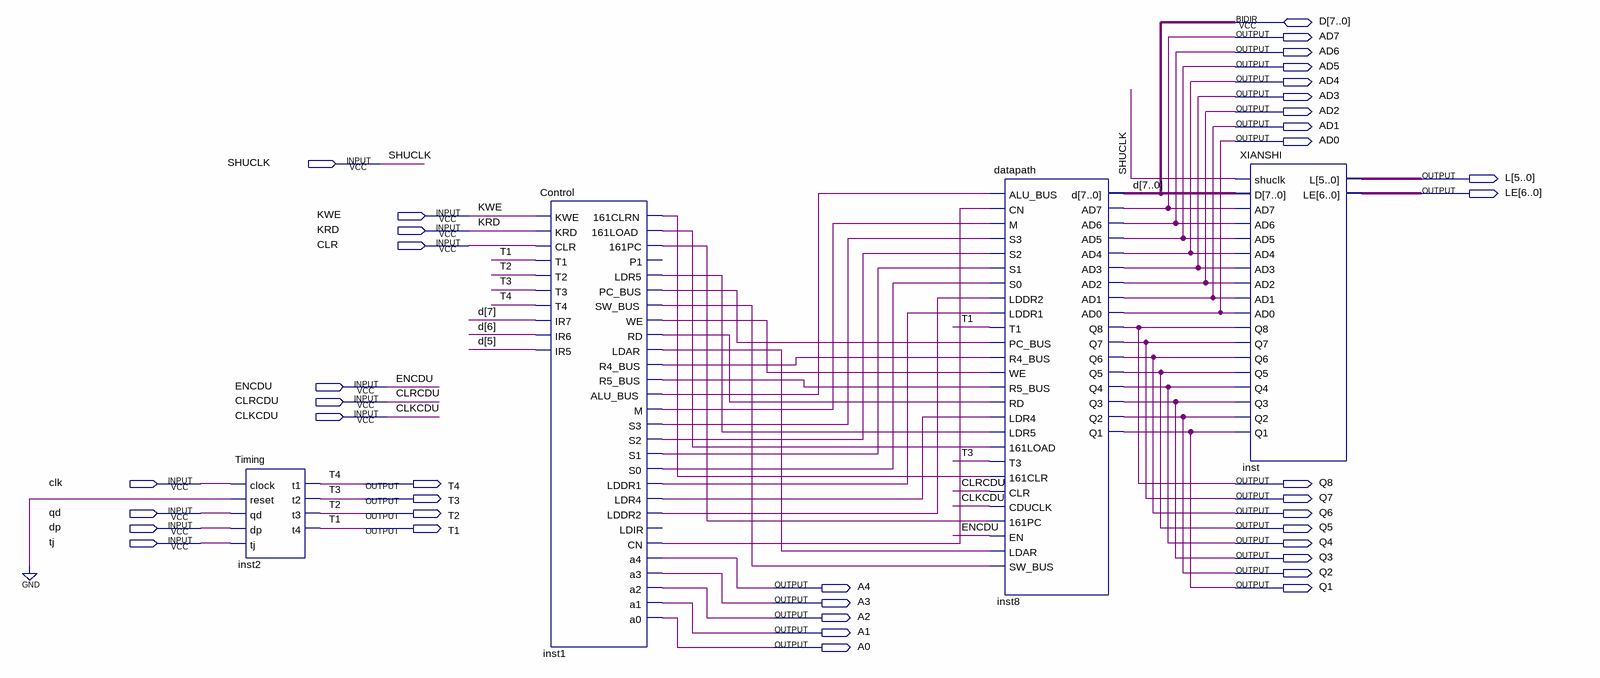
[diagram p0: schematic sheet]
// Quartus schematic Computer.bdf as structural Verilog: 4 symbols, 39 pins
module Computer (
  input  SHUCLK,
  input  KWE,
  input  KRD,
  input  CLR,
  input  ENCDU,
  input  CLRCDU,
  input  CLKCDU,
  input  clk,
  input  qd,
  input  dp,
  input  tj,
  inout  [7:0] D,
  output AD7,
  output AD6,
  output AD5,
  output AD4,
  output AD3,
  output AD2,
  output AD1,
  output AD0,
  output [5:0] L,
  output [6:0] LE,
  output T4,
  output Q8,
  output T3,
  output Q7,
  output T2,
  output Q6,
  output T1,
  output Q5,
  output Q4,
  output Q3,
  output Q2,
  output A4,
  output Q1,
  output A3,
  output A2,
  output A1,
  output A0
);

  wire inst1_161clrn, inst1_161load, inst1_161pc, inst1_alu_bus, inst1_cn, inst1_ldar, inst1_lddr1,
       inst1_lddr2, inst1_ldr4, inst1_ldr5, inst1_m, inst1_pc_bus, inst1_r4_bus, inst1_r5_bus, inst1_rd,
       inst1_s0, inst1_s1, inst1_s2, inst1_s3, inst1_sw_bus, inst1_we;

  Timing inst2 (.clock(clk), .reset(1'b0), .qd(qd), .dp(dp), .tj(tj), .t1(T4), .t2(T3), .t3(T2), .t4(T1));
  Control inst1 (
    .KWE(KWE), .KRD(KRD), .CLR(CLR), .T1(T1), .T2(T2), .T3(T3), .T4(T4), .IR7(D[7]), .IR6(D[6]), .IR5(D[5]),
    .\161CLRN (inst1_161clrn), .\161LOAD (inst1_161load), .\161PC (inst1_161pc), .LDR5(inst1_ldr5),
    .PC_BUS(inst1_pc_bus), .SW_BUS(inst1_sw_bus), .WE(inst1_we), .RD(inst1_rd), .LDAR(inst1_ldar),
    .R4_BUS(inst1_r4_bus), .R5_BUS(inst1_r5_bus), .ALU_BUS(inst1_alu_bus), .M(inst1_m), .S3(inst1_s3),
    .S2(inst1_s2), .S1(inst1_s1), .S0(inst1_s0), .LDDR1(inst1_lddr1), .LDR4(inst1_ldr4), .LDDR2(inst1_lddr2),
    .CN(inst1_cn), .a4(A4), .a3(A3), .a2(A2), .a1(A1), .a0(A0));  // open: P1, LDIR
  datapath inst8 (
    .ALU_BUS(inst1_alu_bus), .CN(inst1_cn), .M(inst1_m), .S3(inst1_s3), .S2(inst1_s2), .S1(inst1_s1),
    .S0(inst1_s0), .LDDR2(inst1_lddr2), .LDDR1(inst1_lddr1), .T1(T1), .PC_BUS(inst1_pc_bus),
    .R4_BUS(inst1_r4_bus), .WE(inst1_we), .R5_BUS(inst1_r5_bus), .RD(inst1_rd), .LDR4(inst1_ldr4),
    .LDR5(inst1_ldr5), .\161LOAD (inst1_161load), .T3(T3), .\161CLR (inst1_161clrn), .CLR(CLRCDU),
    .CDUCLK(CLKCDU), .\161PC (inst1_161pc), .EN(ENCDU), .LDAR(inst1_ldar), .SW_BUS(inst1_sw_bus), .AD7(AD7),
    .AD6(AD6), .AD5(AD5), .AD4(AD4), .AD3(AD3), .AD2(AD2), .AD1(AD1), .AD0(AD0), .Q8(Q8), .Q7(Q7), .Q6(Q6),
    .Q5(Q5), .Q4(Q4), .Q3(Q3), .Q2(Q2), .Q1(Q1), .d(D));
  XIANSHI inst (
    .shuclk(SHUCLK), .D(D), .AD7(AD7), .AD6(AD6), .AD5(AD5), .AD4(AD4), .AD3(AD3), .AD2(AD2), .AD1(AD1),
    .AD0(AD0), .Q8(Q8), .Q7(Q7), .Q6(Q6), .Q5(Q5), .Q4(Q4), .Q3(Q3), .Q2(Q2), .Q1(Q1), .L(L), .LE(LE));
endmodule
